# EasyEDA Pro project 基于STM32四足机器人工程.epro

# Schematic 原理图
Board Name: Board1; Create Date: 2025-08-05; Page Name: P1; Project Name: 基于STM32的四足机器人; Schematic Name: 原理图; Update Date: 2025-10-21; BladeWidth: 10; Company: 嘉立创EDA; Page Size: A4; RegionStart: 1; ShowBorder: 1; TitleBlock: 1; TitleBlockPosition: 3; Version: V1.0; XRegionCount: 6; YRegionCount: 4
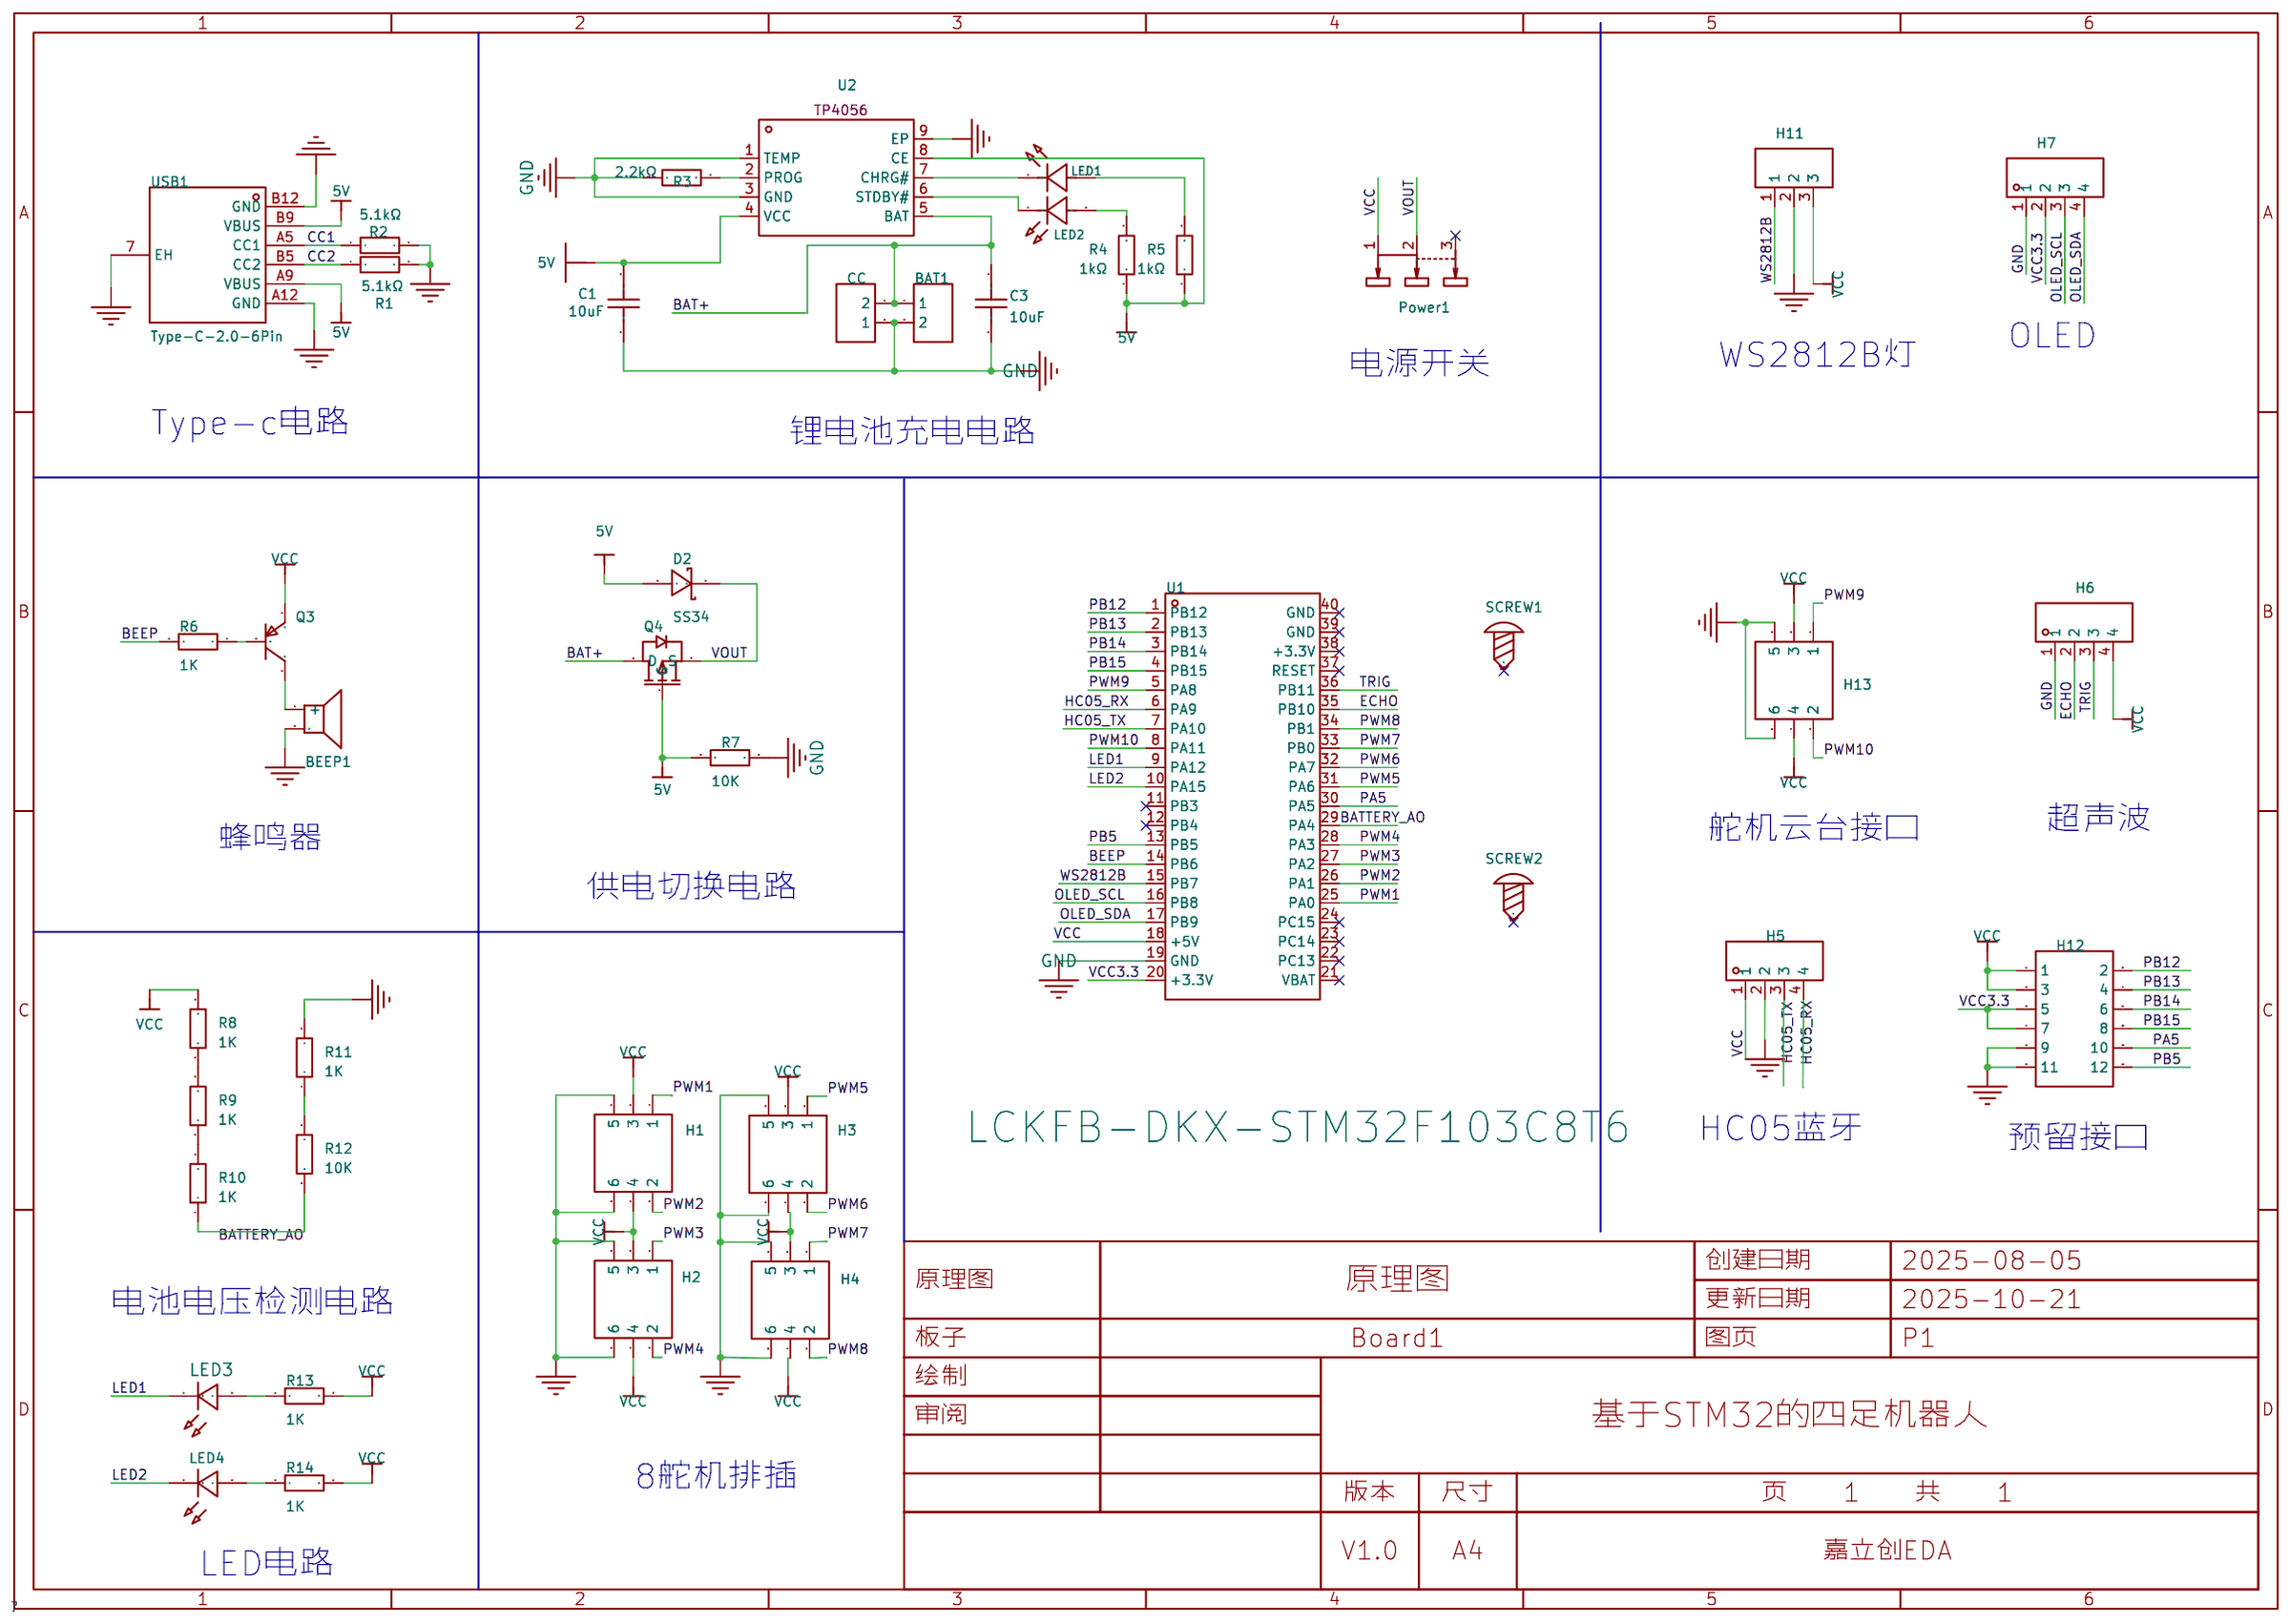
[diagram p0: schematic sheet]

## Parts
BAT1  -  [HDR-TH_2P-P2.54-V-F]
BUZZER1  BEEP1  [BUZ-TH_BD12.0-P7.60-D0.6-FD]
C1  10uF  [C0603]
C3  10uF  [C0603]
CC  CC  [HDR-TH_2P-P2.54-V-F]
D2  SS34  [SMA_L4.3-W2.6-LS5.2-RD]
H1  -  [HDR-TH_6P-P2.54-V-F-R2-C3-S2.54]
H2  -  [HDR-TH_6P-P2.54-V-F-R2-C3-S2.54]
H3  -  [HDR-TH_6P-P2.54-V-F-R2-C3-S2.54]
H4  -  [HDR-TH_6P-P2.54-V-F-R2-C3-S2.54]
H5  -  [HDR-TH_4P-P2.54-V-F]
H6  -  [HDR-TH_4P-P2.54-V-F]
H7  -  [HDR-TH_4P-P2.54-V-F]
H11  -  [HDR-TH_3P-P2.54-V-F]
H12  -  [HDR-TH_12P-P2.54-V-M-R2-C6-S2.54]
H13  -  [HDR-TH_6P-P2.54-V-F-R2-C3-S2.54]
LED1  -  [LED0805-RD_RED]
LED2  -  [LED0805-RD_GREEN]
LED3  -  [LED_0805]
LED4  -  [LED_0805]
Power1  SS-12D10L5  [SW-TH_SS-12D10L5]
Q3  SS8550 Y2(RANGE:200-350)  [SOT-23-3_L2.9-W1.3-P1.90-LS2.4-BR]
Q4  -  [AO3401A_SOT-23-3]
R1  5.1kΩ  [R0603]
R2  5.1kΩ  [R0603]
R3  2.2kΩ  [R0603]
R4  1kΩ  [R0603]
R5  1kΩ  [R0603]
R6  1K  [R0603]
R7  10K  [R0603]
R8  1K  [R0603]
R9  1K  [R0603]
R10  1K  [R0603]
R11  1K  [R0603]
R12  10K  [R0603]
R13  1K  [R0603]
R14  1K  [R0603]
SCREW1  -  [M3螺丝]
SCREW2  -  [M3螺丝]
U1  LCKFB-DKX-STM32F103C8T6  [CONN-TH_L53.3-W22.9_STM32F103C8T6-CARD]
U2  -  [ESOP-8_L4.9-W3.9-P1.27-LS6.0-BL-EP]
USB1  Type-C-2.0-6Pin  [TYPE-C-SMD_TYPE-C-6P-2]

## Library data of the parts
BAT1 CC = HDR-F_2.54_1x2P: Supplier Part: C49661; Supplier Footprint: 插件
BUZZER1 = TMB12A05_C96093: 驱动方式:有源(内含驱动线路);构造类型:电磁式;频率:2.7kHz;声压(SPL):85dB;; LCSC Part Name: TMB12A05; Supplier Part: C96093; Manufacturer: 华能; Manufacturer Part: TMB12A05; Supplier Footprint: 插件,D=12mm; JLCPCB Part Class: 扩展库; Datasheet: https://atta.szlcsc.com/upload/public/pdf/source/20230426/A4FC10532558AA232D532AB83455FBA4.pdf; Supplier: LCSC; Oscillator Circuit: 有源(内含驱动线路); Technology Type: 电磁式; Operating Voltage: 4V~8V; Sound Pressure Level (SPL): 85dB; Diameter (φD): 12mm; Height: 9.8mm
C1 = CL10A106KP8NNNC: 容值:10uF;精度:±10%;额定电压:10V;材质(温度系数):X5R;; LCSC Part Name: 10uF ±10% 10V; Supplier Part: C19702; Manufacturer: SAMSUNG(三星); Supplier Footprint: 0603; JLCPCB Part Class: 基础库; Datasheet: https://atta.szlcsc.com/upload/public/pdf/source/20160218/1457707763339.pdf; Supplier: LCSC; Tolerance: ±10%; Voltage Rated: 10V; Temperature Coefficient: X5R
C3 = CC0603KRX7R9BB104: 容值:100nF;精度:±10%;额定电压:50V;材质(温度系数):X7R;; LCSC Part Name: 100nF ±10% 50V; Supplier Part: C14663; Manufacturer: YAGEO(国巨); Supplier Footprint: 0603; JLCPCB Part Class: 基础库; Datasheet: https://atta.szlcsc.com/upload/public/pdf/source/20180910/C282072_33301C7F631E79921B82A8DAC6BCC5B3.pdf; Supplier: LCSC; Tolerance: ±10%; Voltage Rated: 50V; Temperature Coefficient: X7R
D2 = SS34_C8678: 二极管配置:独立式;正向压降(Vf):550mV@3A;直流反向耐压(Vr):40V;整流电流:3A;; LCSC Part Name: 电压:40V 电流:3A; Supplier Part: C8678; Manufacturer: MDD(辰达半导体); Supplier Footprint: SMA(DO-214AC); JLCPCB Part Class: 基础库; Datasheet: https://atta.szlcsc.com/upload/public/pdf/source/20230314/A80AE34493C69B89E2F4B1712F433538.pdf; Supplier: LCSC; Diode Configuration: 独立式; Forward Voltage (Vf@If): 550mV@3A; Reverse Voltage (Vr): 40V; Rectified Current: 3A; Reverse Leakage Current (Ir): 500uA@40V
H1-H4 H13 = HDR-F_2.54_2x3: Supplier Part: C92272; Supplier Footprint: 插件
H5 H7 = HDR-F_2.54_1x4P: Supplier Part: C2718488; Supplier Footprint: 插件
H6 = HDR-F_2.54_1x4P: Supplier Part: C2718488; Supplier Footprint: 插件; Supplier: LCSC; Manufacturer: BOOMELE(博穆精密); Manufacturer Part: 2.54-1*4P母; JLCPCB Part Class: Extended Part
H11 = HDR-F_2.54_1x3P: Supplier Part: C541850; Supplier Footprint: 插件
H12 = HDR-F_2.54_2x6
LED1 = RF-OGB170TS-CB-E0: 发光颜色:橙红;二极管配置:-;透镜颜色:-;主波长:-;峰值波长:-;色温:-;光通量(25时):-;测试电流:20mA;正向电压(VF):-;发光强度:-;功率:72mW;发光角度:140°;安装方式:正贴;工作温度:-40~+85;; LCSC Part Name: 橙红 正贴; Supplier Part: C2908307; Manufacturer: Refond(瑞丰); Supplier Footprint: 0805; Datasheet: https://atta.szlcsc.com/upload/public/pdf/source/20211101/17CF98FF0F75CAC71B7640EDEC18BF59.pdf; Supplier: LCSC; Emitted Color: 橙红; Forward Current: 20mA; Power Dissipation: 72mW; Viewing Angle: 140°; Mounting Sytle: 正贴; Operating Temperature: -40~+85
LED2 = XL-2012UGC: LCSC Part Name: 绿色; Supplier Part: C965815; Manufacturer: XINGLIGHT(成兴光); Supplier Footprint: 0805; JLCPCB Part Class: Extended Part; Datasheet: https://atta.szlcsc.com/upload/public/pdf/source/20210120/C965815_2FE53C37585AA3C6FB1151B9997EA267.pdf; Supplier: LCSC
LED3 = LED_0805-R: Supplier Footprint: 0805
LED4 = LED_0805-B: Supplier Footprint: 0805
Power1 = SS-12D10L5: 电路结构:单刀双掷;安装方式:直插;开关颜色:黑色;额定电流(DC):3A;额定电压(DC):125V;额定电流(AC):3A;额定电压(AC):125V;机械寿命:1万次;; LCSC Part Name: 柄长5mm 直插双档 滑动开关; Supplier Part: C319012; Manufacturer: XKB Connectivity(中国星坤); Supplier Footprint: 插件; JLCPCB Part Class: 扩展库; Datasheet: https://atta.szlcsc.com/upload/public/pdf/source/20211009/D6412F37AABE6F9459A6EE7FA4DAEADB.pdf; Supplier: LCSC; Circuit: 单刀双掷; Actuator Style: 矩形柱状; Pin Style: PC引脚; Switch Length: 13mm; Switch Width: 6.8mm; Switch Height: 6.4mm; Mounting Style: 直插; Actuator Color: 黑色; Current Rating (DC): 3A; Voltage Rating (DC): 125V; Current Rating (AC): 3A; Voltage Rating (AC): 125V; Mechanical Life: 1万次; Operating Temperature: -40℃~+85℃
Q3 = SS8550 Y2(RANGE:200-350): 晶体管类型:PNP;集电极电流(Ic):1.5A;集射极击穿电压(Vceo):25V;功率(Pd):300mW;直流电流增益(hFE@Ic,Vce):200@100mA,1V;; LCSC Part Name: PNP 电流:1.5A 耐压:25V hfe=200~350; Supplier Part: C8542; Manufacturer: CJ(江苏长电/长晶); Supplier Footprint: SOT-23; JLCPCB Part Class: 基础库; Datasheet: https://atta.szlcsc.com/upload/public/pdf/source/20140809/1457707214734.pdf; Supplier: LCSC; Transistor Type: PNP; Collector Current (Ic): 1.5A; Collector-Emitter Breakdown Voltage (Vceo): 25V; Power Dissipation (Pd): 300mW; DC Current Gain (hFE@Ic,Vce): 200@100mA,1V; Transition Frequency (fT): 100MHz; Collector Cut-Off Current (Icbo): 100nA; Collector-Emitter Saturation Voltage (VCE(sat)@Ic,Ib): 500mV@800mA,80mA; Operating Temperature: -55℃~+150℃
Q4 = AO3401A_P: Supplier Footprint: SOT-23-3L; Supplier Part: C15127
R1 R2 = RT0603BRD075K1L: 电阻类型:薄膜电阻;阻值:5.1kΩ;精度:±0.1%;功率:100mW;最大工作电压:75V;温度系数:±25ppm/℃;; LCSC Part Name: 薄膜电阻 5.1kΩ ±0.1% 100mW; Supplier Part: C122969; Manufacturer: YAGEO(国巨); Supplier Footprint: 0603; Datasheet: https://atta.szlcsc.com/upload/public/pdf/source/20170728/C122969_1501225761505848820.pdf; Supplier: LCSC; Type: 薄膜电阻; Tolerance: ±0.1%; Power(Watts): 100mW; Overload Voltage (Max): 75V; Temperature Coefficient: ±25ppm/℃; Operating Temperature Range: -55℃~+155℃
R3-R5 = 0603WAF2201T5E: 电阻类型:厚膜电阻;阻值:2.2kΩ;精度:±1%;功率:100mW;最大工作电压:75V;温度系数:±100ppm/℃;; LCSC Part Name: 2.2kΩ ±1% 100mW 厚膜电阻; Supplier Part: C4190; Manufacturer: UNI-ROYAL(厚声); Supplier Footprint: 0603; JLCPCB Part Class: 基础库; Datasheet: https://atta.szlcsc.com/upload/public/pdf/source/20200306/C422600_1E6D84923E4A46A82E41ADD87F860B5C.pdf; Supplier: LCSC; Type: 厚膜电阻; Tolerance: ±1%; Power(Watts): 100mW; Overload Voltage (Max): 75V; Temperature Coefficient: ±100ppm/℃; Operating Temperature Range: -55℃~+155℃
R6-R14 = Res_0603: Supplier Footprint: 0603
SCREW1 SCREW2 = M3螺丝: Supplier Footprint: 插件
U1 = LCKFB-DKX-STM32F103C8T6: LCSC Part Name: 立创·地阔星-STM32F103C8T6开发板; Supplier Part: C22396880; Manufacturer: 立创开发板; JLCPCB Part Class: 扩展库; Datasheet: https://atta.szlcsc.com/upload/public/pdf/source/20240801/7EEF69F7480DF7C6DA98696664D658D4.pdf; Supplier: LCSC
U2 = TP4056_1: 充电电池的类型:-;电池单元组数:-;最大充电电流:-;充满的电池组电压:-;最大供应电压:-;; LCSC Part Name: 1A鋰電池充電IC; Supplier Part: C382139; Manufacturer: TPOWER(天源); Manufacturer Part: TP4056; Supplier Footprint: ESOP-8; JLCPCB Part Class: Extended Part; Datasheet: https://atta.szlcsc.com/upload/public/pdf/source/20190327/C382139_EC85960E6FE3E26856C240C81751A184.pdf; Supplier: LCSC
USB1 = Type-C-2.0-6Pin: 连接器类型:Type-C;标准:-;公母:-;端口数量:-;触点数量:-;安装方式:-;额定电流 - 电源:-;触头材质:-;触头镀层:-;工作温度范围:-;; LCSC Part Name: Type-C; Supplier Part: C2987385; Manufacturer: CIKI(皓富); Supplier Footprint: SMD; JLCPCB Part Class: 扩展库; Datasheet: https://atta.szlcsc.com/upload/public/pdf/source/20220407/E50BDDABD954E576FE20B8BF54ED3367.pdf; Supplier: LCSC; Connector Type: Type-C

## Nets
5V: C1.2 D2.2(A) Q4.1(G) R4.1 R5.1 R7.2 U2.4(VCC) U2.8(CE) USB1.A9(VBUS) USB1.B9(VBUS)
GND: BAT1.2 BUZZER1.2 C1.1 C3.1 CC.1 H1.5 H1.6 H2.5 H2.6 H3.5 H3.6 H4.5 H4.6 H5.2 H6.1 H7.1 H11.2 H12.9 H12.11 H13.5 H13.6 R1.2 R2.2 R3.1 R7.1 R11.2 U1.19(GND) U2.1(TEMP) U2.3(GND) U2.9(EP) USB1.7(EH) USB1.A12(GND) USB1.B12(GND)
VCC: H1.4 H2.3 H2.4 H3.3 H3.4 H4.3 H4.4 H5.1 H6.4 H11.3 H12.1 H12.3 H13.3 H13.4 Power1.1 Q3.2(E) R8.2 R13.2 R14.2 U1.18(+5V)
VCC3.3: H7.2 H12.5 H12.7 U1.20(+3.3V)
BAT+: BAT1.1 C3.2 CC.2 Q4.3(D) U2.5(BAT)
BATTERY_AO: R10.1 R12.2 U1.29(PA4)
BEEP: R6.2 U1.14(PB6)
CC1: R2.1 USB1.A5(CC1)
CC2: R1.1 USB1.B5(CC2)
ECHO: H6.2 U1.35(PB10)
HC05_RX: H5.4 U1.6(PA9)
HC05_TX: H5.3 U1.7(PA10)
LED1: LED3.1(C) U1.9(PA12)
LED2: LED4.1(C) U1.10(PA15)
OLED_SCL: H7.3 U1.16(PB8)
OLED_SDA: H7.4 U1.17(PB9)
PA5: H12.10 U1.30(PA5)
PB5: H12.12 U1.13(PB5)
PB12: H12.2 U1.1(PB12)
PB13: H12.4 U1.2(PB13)
PB14: H12.6 U1.3(PB14)
PB15: H12.8 U1.4(PB15)
PWM1: H1.1 U1.25(PA0)
PWM2: H1.2 U1.26(PA1)
PWM3: H2.1 U1.27(PA2)
PWM4: H2.2 U1.28(PA3)
PWM5: H3.1 U1.31(PA6)
PWM6: H3.2 U1.32(PA7)
PWM7: H4.1 U1.33(PB0)
PWM8: H4.2 U1.34(PB1)
PWM9: H13.1 U1.5(PA8)
PWM10: H13.2 U1.8(PA11)
TRIG: H6.3 U1.36(PB11)
VOUT: D2.1(K) Power1.2 Q4.2(S)
WS2812B: H11.1 U1.15(PB7)
$1N791: R3.2 U2.2(PROG)
$1N793: LED2.1(K) U2.6(STDBY#)
$1N794: LED1.1(K) U2.7(CHRG#)
$1N807: LED2.2(A) R4.2
$1N808: LED1.2(A) R5.2
$1N1079: Q3.1(B) R6.1
$1N1080: BUZZER1.1(+) Q3.3(C)
$1N4646: R11.1 R12.1
$1N4647: R8.1 R9.2
$1N4648: R9.1 R10.2
$1N11515: LED3.2(A) R13.1
$1N11583: LED4.2(A) R14.1

Not connected (* = marked no-connect by the designer): H1 3; Power1 3*; SCREW1 1*; SCREW2 1*; U1 11(PB3)* 12(PB4)* 21(VBAT)* 22(PC13)* 23(PC14)* 24(PC15)* 37(RESET)* 38(+3.3V)* 39(GND)* 40(GND)*

## Notes on the sheet
- OLED
- 电源开关
- WS2812B灯
- Type-c电路
- 锂电池充电电路
- 舵机云台接口
- 超声波
- 蜂鸣器
- 供电切换电路
- HC05蓝牙
- 预留接口
- 电池电压检测电路
- 8舵机排插
- LED电路

# Board PCB1
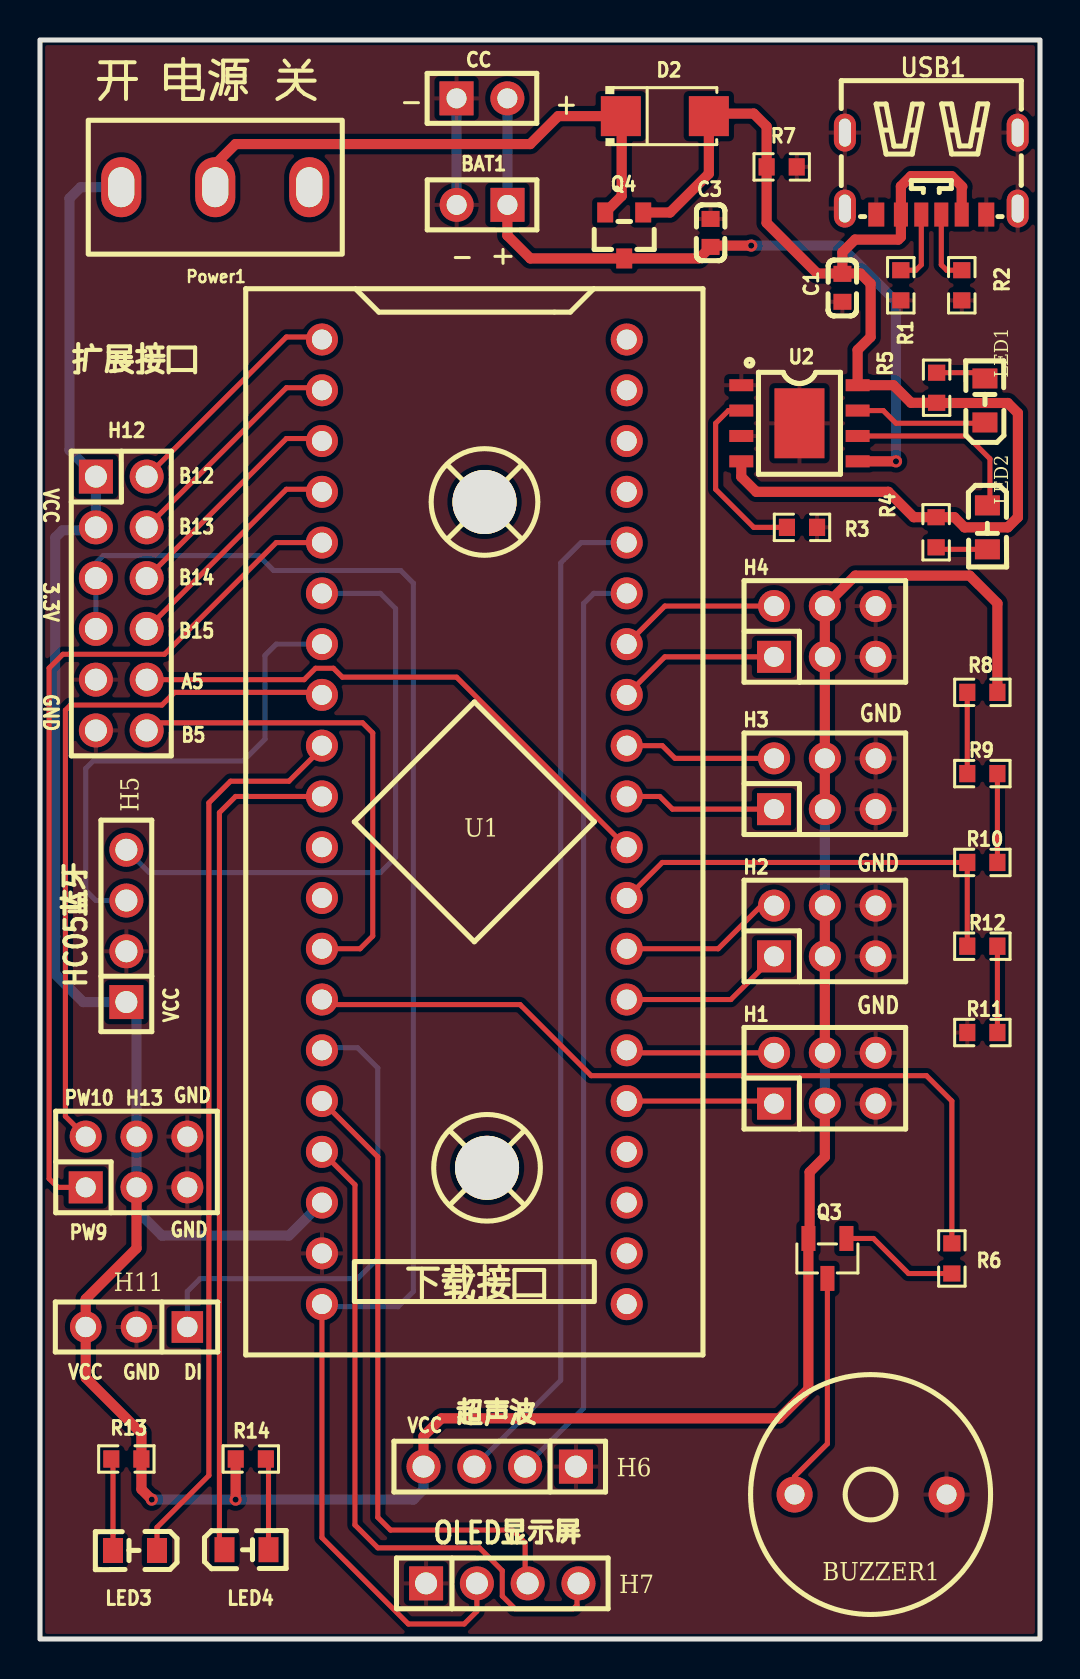
[diagram p1: board, top side]
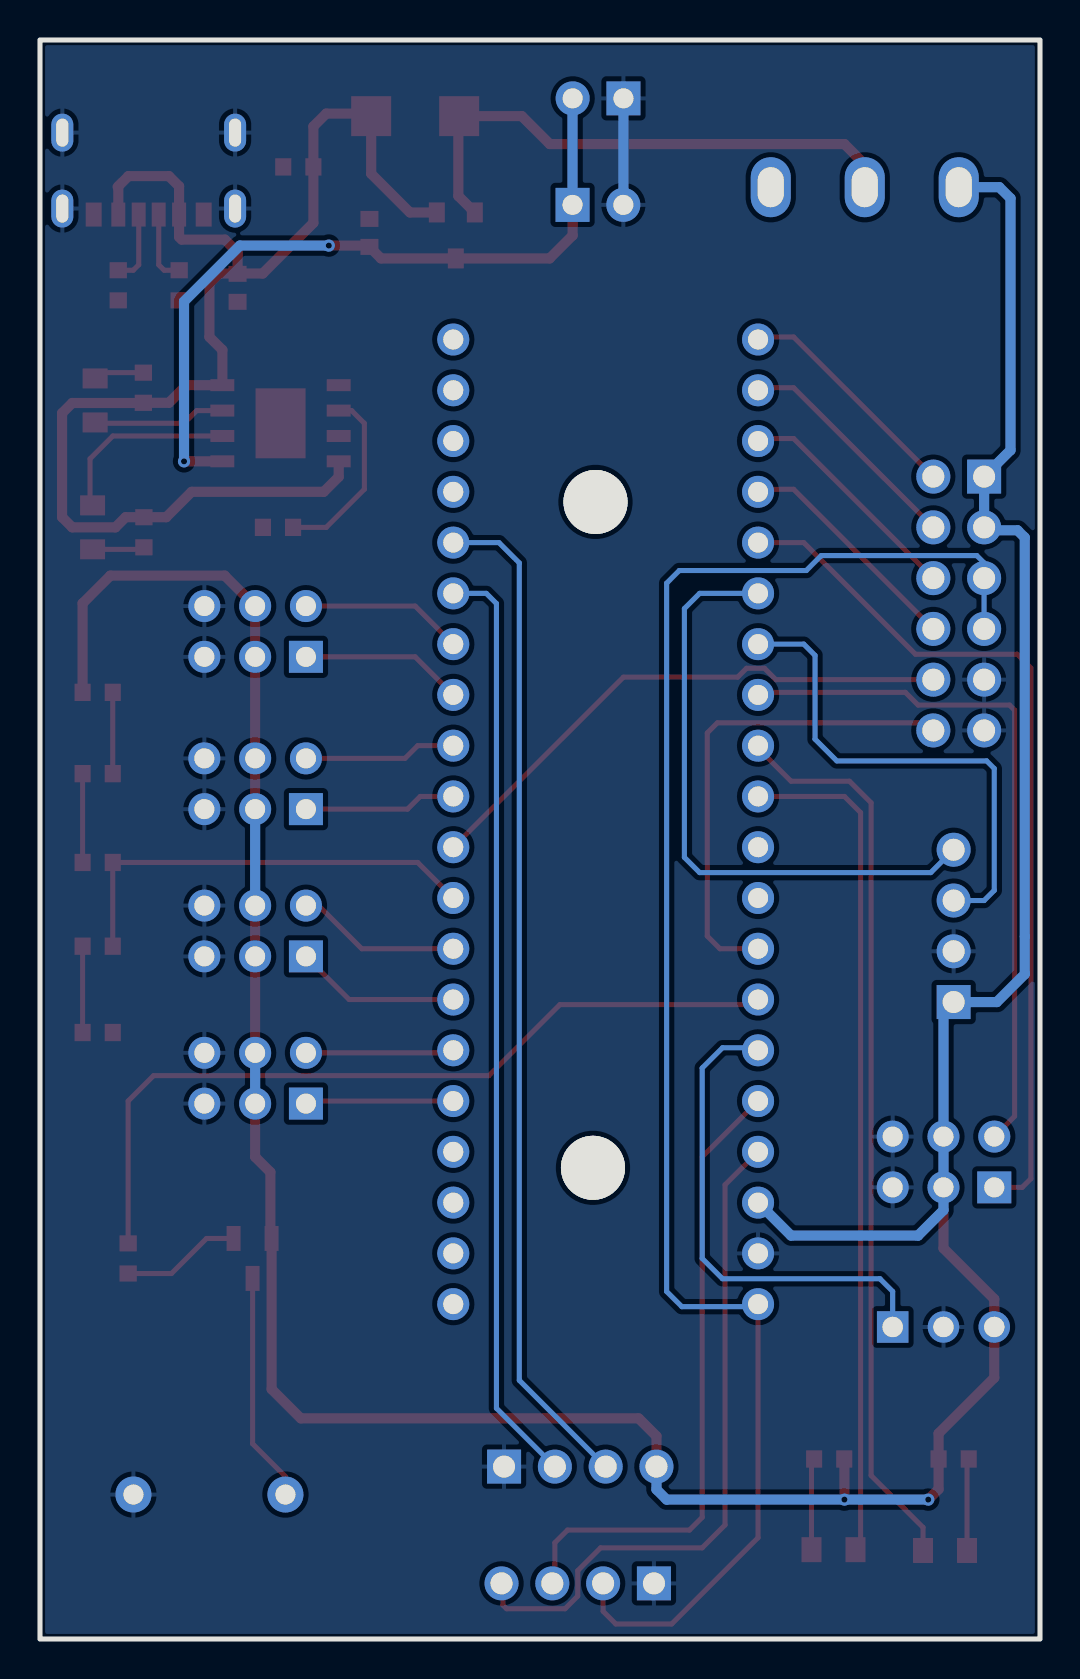
[diagram p2: board, bottom side, seen from below]

Outline 50 x 80 mm; copper layers: Top Layer, Bottom Layer. Coordinates in mm from the lower left corner of the outline.
Outline path: rectangle 0,80 50,0
Stack: Top Layer 0.035mm / Dielectric1 1.51mm FR4 er 4.5 / Bottom Layer 0.035mm

## Design rules (mm)
spacing copperThickness1oz (default): track to track 0.102, other pairs 0.152 to 0.3
spacing copperThickness2oz: track to track 0.203, other pairs 0.152 to 0.3
spacing Plane_innerPlane: track to track 0.102, other pairs 0.152 to 0.3
spacing Copper_copperRegion: track to track 0.102, other pairs 0.152 to 0.3
track width copperThickness1oz (default): min 0.127, default 0.254, max 2.54
track width copperThickness2oz: min 0.203, default 0.254, max 2.54
track width power: min 0.508, default 0.508, max 0.508
differential pair differentialPair (default): width min 0.127, default 0.254, max 2.54; gap min 0.152, default 0.152
net GND uses copperRegion_copperThickness1oz
pour e111 uses Copper_copperRegion, copperRegion_Copper_copperRegion
pour e228 uses Copper_copperRegion, copperRegion_Copper_copperRegion
net BAT+ uses power
net VCC uses power
net 5V uses power
net VOUT uses power

## Placement (name value [footprint] x y rotation side)
BAT1  -  [HDR-TH_2P-P2.54-V-F]  22.1 71.75 180 top
BUZZER1  BEEP1  [BUZ-TH_BD12.0-P7.60-D0.6-FD]  41.53 7.23 0 top
C1  10uF  [C0603]  40.12 67.6 90 top
C3  10uF  [C0603]  33.53 70.35 270 top
CC  CC  [HDR-TH_2P-P2.54-V-F]  22.1 77.08 0 top
D2  SS34  [SMA_L4.3-W2.6-LS5.2-RD]  31.24 76.19 0 top
H1  -  [HDR-TH_6P-P2.54-V-F-R2-C3-S2.54]  39.24 28.06 0 top
H2  -  [HDR-TH_6P-P2.54-V-F-R2-C3-S2.54]  39.24 35.42 0 top
H3  -  [HDR-TH_6P-P2.54-V-F-R2-C3-S2.54]  39.24 42.79 0 top
H4  -  [HDR-TH_6P-P2.54-V-F-R2-C3-S2.54]  39.24 50.41 0 top
H5  -  [HDR-TH_4P-P2.54-V-F]  4.32 35.68 90 top
H6  -  [HDR-TH_4P-P2.54-V-F]  22.99 8.63 180 top
H7  -  [HDR-TH_4P-P2.54-V-F]  23.11 2.78 0 top
H11  -  [HDR-TH_3P-P2.54-V-F]  4.83 15.61 180 top
H12  -  [HDR-TH_12P-P2.54-V-M-R2-C6-S2.54]  4.06 51.81 270 top
H13  -  [HDR-TH_6P-P2.54-V-F-R2-C3-S2.54]  4.83 23.87 0 top
LED1  -  [LED0805-RD_RED]  47.24 61.97 90 top
LED2  -  [LED0805-RD_GREEN]  47.37 55.62 270 top
LED3  -  [LED_0805]  4.7 4.44 180 top
LED4  -  [LED_0805]  10.38 4.46 0 top
Power1  SS-12D10L5  [SW-TH_SS-12D10L5]  8.76 72.63 0 top
Q3  SS8550 Y2(RANGE:200-350)  [SOT-23-3_L2.9-W1.3-P1.90-LS2.4-BR]  39.37 19.04 90 top
Q4  -  [AO3401A_SOT-23-3]  29.21 70.22 90 top
R1  5.1kΩ  [R0603]  43.04 67.73 270 top
R2  5.1kΩ  [R0603]  46.09 67.73 270 top
R3  2.2kΩ  [R0603]  38.1 55.62 180 top
R4  1kΩ  [R0603]  44.81 55.37 270 top
R5  1kΩ  [R0603]  44.83 62.6 90 top
R6  1K  [R0603]  45.59 19.04 90 top
R7  10K  [R0603]  37.08 73.65 180 top
R8  1K  [R0603]  47.12 47.36 0 top
R9  1K  [R0603]  47.12 43.3 180 top
R10  1K  [R0603]  47.12 38.85 0 top
R11  1K  [R0603]  47.12 30.34 180 top
R12  10K  [R0603]  47.12 34.66 180 top
R13  1K  [R0603]  4.32 9.01 0 top
R14  1K  [R0603]  10.54 9.01 180 top
SCREW1  -  [M3螺丝]  22.35 23.57 0 top
SCREW2  -  [M3螺丝]  22.22 56.89 0 top
U1  LCKFB-DKX-STM32F103C8T6  [CONN-TH_L53.3-W22.9_STM32F103C8T6-CARD]  21.72 40.88 270 top
U2  -  [ESOP-8_L4.9-W3.9-P1.27-LS6.0-BL-EP]  37.97 60.82 270 top
USB1  Type-C-2.0-6Pin  [TYPE-C-SMD_TYPE-C-6P-2]  44.56 73.32 180 top

## Footprints (pads in the part's own frame, mm; a bottom-side part is the same pattern mirrored in y, then rotated)
AO3401A_SOT-23-3
  rect 1x0.8 smd: 1(1.15,-0.95) 2(1.15,0.95) 3(-1.15,0)
BUZ-TH_BD12.0-P7.60-D0.6-FD
  round 1.8 hole 1: 1(-3.8,0) 2(3.8,0)
C0603
  rect 0.8x0.9 smd: 1(-0.7,0) 2(0.7,0)
CONN-TH_L53.3-W22.9_STM32F103C8T6-CARD
  round 1.6 hole 1: 1(-24.13,-7.62) 2(-21.59,-7.62) 3(-19.05,-7.62) 4(-16.51,-7.62) 5(-13.97,-7.62) 6(-11.43,-7.62) 7(-8.89,-7.62) 8(-6.35,-7.62) 9(-3.81,-7.62) 10(-1.27,-7.62) 11(1.27,-7.62) 12(3.81,-7.62) 13(6.35,-7.62) 14(8.89,-7.62) 15(11.43,-7.62) 16(13.97,-7.62) 17(16.51,-7.62) 18(19.05,-7.62) 19(21.59,-7.62) 20(24.13,-7.62) 21(24.13,7.62) 22(21.59,7.62) 23(19.05,7.62) 24(16.51,7.62) 25(13.97,7.62) 26(11.43,7.62) 27(8.89,7.62) 28(6.35,7.62) 29(3.81,7.62) 30(1.27,7.62) 31(-1.27,7.62) 32(-3.81,7.62) 33(-6.35,7.62) 34(-8.89,7.62) 35(-11.43,7.62) 36(-13.97,7.62) 37(-16.51,7.62) 38(-19.05,7.62) 39(-21.59,7.62) 40(-24.13,7.62)
ESOP-8_L4.9-W3.9-P1.27-LS6.0-BL-EP
  rect 0.6x1.199 smd: 1(-1.905,-2.909) 2(-0.635,-2.909) 3(0.635,-2.909) 4(1.905,-2.909) 5(1.905,2.909) 6(0.635,2.909) 7(-0.635,2.909) 8(-1.905,2.909)
  rect 3.5x2.499 smd: 9(0,0)
HDR-TH_2P-P2.54-V-F
  rect 1.7x1.7 hole 1: 1(-1.27,0)
  round 1.7 hole 1: 2(1.27,0)
HDR-TH_3P-P2.54-V-F
  rect 1.575x1.575 hole 1.02: 1(-2.54,0)
  round 1.575 hole 1.02: 2(0,0) 3(2.54,0)
HDR-TH_4P-P2.54-V-F
  rect 1.7x1.7 hole 1.1: 1(-3.81,0)
  round 1.7 hole 1.1: 2(-1.27,0) 3(1.27,0) 4(3.81,0)
HDR-TH_6P-P2.54-V-F-R2-C3-S2.54
  rect 1.7x1.6 hole 1: 1(-2.54,-1.27)
  round 1.6 hole 1: 2(-2.54,1.27) 3(0,-1.27) 4(0,1.27) 5(2.54,-1.27) 6(2.54,1.27)
HDR-TH_12P-P2.54-V-M-R2-C6-S2.54
  rect 1.7x1.7 hole 1.1: 1(-6.35,-1.27)
  round 1.7 hole 1.1: 2(-6.35,1.27) 3(-3.81,-1.27) 4(-3.81,1.27) 5(-1.27,-1.27) 6(-1.27,1.27) 7(1.27,-1.27) 8(1.27,1.27) 9(3.81,-1.27) 10(3.81,1.27) 11(6.35,-1.27) 12(6.35,1.27)
LED0805-RD_GREEN
  rect 1.001x1.25 smd: 1(-1.1,0) 2(1.1,0)
LED0805-RD_RED
  rect 1x1.25 smd: 1(-1.1,0) 2(1.1,0)
LED_0805
  rect 1x1.25 smd: 1(-1.15,0.005) 2(1.05,0.005)
M3螺丝
  round 3.2 hole 3.2: 1(0,0)
R0603
  rect 0.806x0.864 smd: 1(-0.753,0) 2(0.753,0)
SMA_L4.3-W2.6-LS5.2-RD
  rect 2x2 smd: 1(-2.2,0) 2(2.2,0)
SOT-23-3_L2.9-W1.3-P1.90-LS2.4-BR
  rect 1.25x0.7 smd: 1(1,-0.95) 2(1,0.95) 3(-1,0)
SW-TH_SS-12D10L5
  oval 2x3 hole 1.3x2: 1(-4.7,0) 2(0,0) 3(4.7,0)
TYPE-C-SMD_TYPE-C-6P-2
  oval 1.1x1.9 hole 0.6x1.4: 7(-4.32,1.75) 7(-4.32,-2.05) 7(4.32,1.75) 7(4.32,-2.05)
  rect 0.7x1.2 smd: A5(-0.5,2.05) A9(1.52,2.05) B5(0.5,2.05) B9(-1.52,2.05)
  rect 0.8x1.2 smd: A12(2.75,2.05) B12(-2.75,2.05)

## Nets
As in the schematic, except:
VCC: H1.3 H1.4 H2.3 H2.4 H3.3 H3.4 H4.3 H4.4 H5.1 H6.4 H11.3 H12.1 H12.3 H13.3 H13.4 Power1.1 Q3.2 R8.2 R13.2 R14.2 U1.18

Pads without a net: Power1 3; SCREW1 1; SCREW2 1; U1 11 12 21 22 23 24 37 38 39 40

## Via types
v1: diameter 0.61, hole 0.305, Top Layer to Bottom Layer, 4 vias

## Routing (per net, layer and track width the routed paths; a pad name or vN(x,y) marks a point on that pad's centre or on a via; arc(x,y) is an arc through that point)
5V: length 68.2
  Top Layer w0.508: 46.08,72.65 USB1.B9 ; Q4.1 31.5,71.37 33.44,73.31 D2.2 33.57,76.32 35.69,76.32 36.33,75.67 R7.2 36.33,70.85 38.86,68.32 40.1,68.32 C1.2 ; 46.12,72.65 45.58,73.19 43.55,73.19 43.04,72.68 USB1.A9 43.04,70.14 42.91,70.01 40.75,70.01 40.12,69.38 C1.2 ; C1.2 40.13,68.32 41.02,68.32 41.53,67.81 41.53,65.14 40.88,64.49 U2.8 42.67,62.73 43.55,61.85 R5.1 44.84,61.84 48.39,61.84 48.9,61.33 48.9,56.12 48.39,55.62 46.23,55.62 45.72,56.12 R4.1 43.69,56.12 42.42,57.39 35.81,57.39 35.06,58.14 U2.4
GND: length 5.3
  Bottom Layer w0.508: BAT1.2 20.83,71.75 CC.1
VCC: length 179.7
  Top Layer w0.508: H2.4 H2.3 H1.4 ; H13.3 4.83,19.55 2.29,17.01 H11.3 2.29,13.07 5.07,10.29 R13.2 5.07,7.49 v1(5.59,6.97) ; H3.3 H3.4 H4.3 H4.4 40.77,53.2 46.48,53.2 47.87,51.81 R8.2 ; H1.3 39.24,24.12 38.48,23.36 38.48,20.1 Q3.2 38.42,12.5 36.96,11.04 20.07,11.04 19.18,10.15 H6.4 ; R14.2 9.78,9 v1(9.78,6.97)
  Bottom Layer w0.508: 0.76,35.17 0.76,55.11 1.12,55.47 2.65,55.47 H12.3 H12.1 1.47,59.48 1.47,72.08 2.03,72.63 4.06,72.63 ; H1.4 H1.3 ; 14.1,21.83 12.45,20.18 6.1,20.18 4.83,21.45 H13.3 H13.4 4.83,31.36 H5.1 2.16,31.87 0.76,33.26 0.76,35.13 ; v1(5.59,6.97) v1(9.78,6.97) 18.67,6.97 19.18,7.48 H6.4 ; H2.4 H3.3
VCC3.3: length 83
  Top Layer w0.254: 14.1,16.75 14.1,5.07 18.41,0.75 21.21,0.75 21.84,1.39 H7.2
  Bottom Layer w0.254: 14.22,16.63 17.91,16.63 18.67,17.39 18.67,52.82 18.03,53.46 11.68,53.46 10.94,54.2 3.16,54.2 2.79,53.84 H12.5 H12.7
BAT+: length 38.1
  Top Layer w0.508: v1(35.56,69.71) 33.59,69.71 C3.2 32.95,69.07 Q4.3 24.52,69.07 23.37,70.22 23.37,71.74 BAT1.1 ; U2.5 v1(42.8,58.92)
  Bottom Layer w0.508: BAT1.1 23.37,77.07 CC.2 ; v1(35.56,69.71) 40,69.71 42.8,66.92 v1(42.8,58.92)
BATTERY_AO: length 22
  Top Layer w0.254: U1.29 31.12,38.85 R10.1 R12.2
BEEP: length 40.8
  Top Layer w0.254: R6.2 45.59,26.91 44.32,28.18 27.56,28.18 24,31.74 14.22,31.74 14.1,31.87 14.1,31.99
CC1: length 3.7
  Top Layer w0.254: R2.1 45.34,68.48 45.06,68.75 USB1.A5
CC2: length 3.7
  Top Layer w0.254: USB1.B5 44.06,68.75 43.79,68.48 R1.1
ECHO: length 46.8
  Bottom Layer w0.254: U1.35 27.69,52.31 27.18,51.81 27.18,11.55 H6.2
HC05_RX: length 30.7
  Bottom Layer w0.254: 14.1,52.31 17.02,52.31 17.78,51.55 17.78,39.11 17.02,38.34 5.46,38.34 H5.4
HC05_TX: length 25.2
  Bottom Layer w0.254: 14.1,49.77 11.81,49.77 11.25,49.21 11.25,45.02 10.16,43.93 2.67,43.93 2.29,43.55 2.29,37.45 2.79,36.95 H5.3
LED1: length 45.4
  Top Layer w0.254: LED3.1 5.85,5.58 8.44,8.18 8.44,41.84 9.53,42.92 12.45,42.92 14.1,44.57 14.1,44.69
LED2: length 42.4
  Top Layer w0.254: 9.22,4.47 8.97,4.72 8.97,41.35 9.78,42.15 14.1,42.15
OLED_SCL: length 32
  Top Layer w0.254: H7.3 24.26,2.91 24.26,4.82 23.62,5.45 17.53,5.45 16.89,6.09 16.89,24.12 14.1,26.91
OLED_SDA: length 34.1
  Top Layer w0.254: 14.1,24.37 15.75,22.72 15.75,5.7 16.89,4.56 21.97,4.56 23.11,3.42 23.11,2.15 23.75,1.51 26.67,1.51 26.85,1.69 26.85,2.71 H7.4
PA5: length 27.9
  Top Layer w0.254: U1.30 20.83,48.12 15.12,48.12 14.67,48.57 13.78,48.57 13.21,48 H12.10
PB5: length 24.6
  Top Layer w0.254: 14.1,34.53 16,34.53 16.64,35.17 16.64,45.33 16.13,45.84 5.72,45.84 H12.12
PB12: length 11.7
  Top Layer w0.254: 14.1,65.14 12.32,65.14 H12.2
PB13: length 11.7
  Top Layer w0.254: 14.1,62.6 12.32,62.6 H12.4
PB14: length 11.7
  Top Layer w0.254: H12.6 12.32,60.06 14.1,60.06
PB15: length 11.7
  Top Layer w0.254: 14.1,57.52 12.32,57.52 H12.8
PWM1: length 7.4
  Top Layer w0.254: H1.1 36.58,26.91 U1.25
PWM2: length 7.4
  Top Layer w0.254: H1.2 29.46,29.33 U1.26
PWM3: length 8.3
  Top Layer w0.254: H2.1 34.54,31.99 U1.27
PWM4: length 8.3
  Top Layer w0.254: H2.2 36.07,36.69 33.91,34.53 U1.28
PWM5: length 7.6
  Top Layer w0.254: H3.1 31.62,41.52 30.99,42.15 U1.31
PWM6: length 7.6
  Top Layer w0.254: U1.32 31.12,44.69 31.75,44.06 H3.2
PWM7: length 8.2
  Top Layer w0.254: H4.1 31.24,49.14 U1.33
PWM8: length 8.2
  Top Layer w0.254: U1.34 31.24,51.68 H4.2
PWM9: length 43.8
  Top Layer w0.254: H13.1 0.89,22.6 0.46,23.03 0.46,48.58 1.14,49.27 6.22,49.27 11.81,54.85 14.1,54.85
PWM10: length 35
  Top Layer w0.254: 14.1,47.23 13.97,47.36 6.73,47.36 6.1,46.73 1.52,46.73 1.27,46.47 1.27,26.15 H13.2
TRIG: length 50.7
  Bottom Layer w0.254: H6.3 26.03,12.94 26.03,53.84 27.05,54.85 U1.36
VOUT: length 27.6
  Top Layer w0.508: Q4.2 29.08,72.19 29.08,76.15 D2.1 25.91,76.19 24.51,74.79 9.78,74.79 8.76,73.78 Power1.2
WS2812B: length 24.8
  Bottom Layer w0.254: H11.1 7.37,17.39 8,18.02 15.88,18.02 16.89,19.04 16.89,28.56 15.88,29.58 14.22,29.58 14.1,29.45
$1N791: length 9.2
  Top Layer w0.254: R3.2 35.69,55.62 33.78,57.52 33.78,60.82 34.42,61.46 U2.2
$1N793: length 9.5
  Top Layer w0.254: U2.6 46.35,60.19 47.5,59.04 47.5,56.84 LED2.1
$1N794: length 6.6
  Top Layer w0.254: LED1.1 47.2,60.82 42.8,60.82 42.16,61.46 U2.7
$1N807: length 2.6
  Top Layer w0.254: 44.81,54.62 44.91,54.52 LED2.2
$1N808: length 2.5
  Top Layer w0.254: R5.2 46.96,63.35 LED1.2
$1N1079: length 6
  Top Layer w0.254: Q3.1 41.67,20.04 43.43,18.29 R6.1
$1N1080: length 11.5
  Top Layer w0.254: BUZZER1.1 37.73,8.13 39.37,9.77 Q3.3
$1N4646: length 4.3
  Top Layer w0.254: R12.1 R11.1
$1N4647: length 4.1
  Top Layer w0.254: R8.1 R9.2
$1N4648: length 4.4
  Top Layer w0.254: R9.1 R10.2
$1N11515: length 4.6
  Top Layer w0.254: LED3.2 3.65,8.92 R13.1
$1N11583: length 4.6
  Top Layer w0.254: R14.1 11.43,8.88 LED4.2

## Copper pours and planes (outline as drawn; the poured copper is in the pictures)
GND on Top Layer: 0,80 50,80 50,0 0,0
GND on Bottom Layer: 0,80 50,80 50,0 0,0

## Text on the board
Top Silkscreen Layer: PW10 | VCC | PW9 | GND | B12 | B13 | B14 | B15 | A5 | B5 | DI | 3.3V | - | + | 下载接口 | OLED显示屏 | 超声波 | HC05蓝牙 | 扩展接口 | 开 电源 关
